# EAGLE schematic adc (EAGLE 6.5.0)
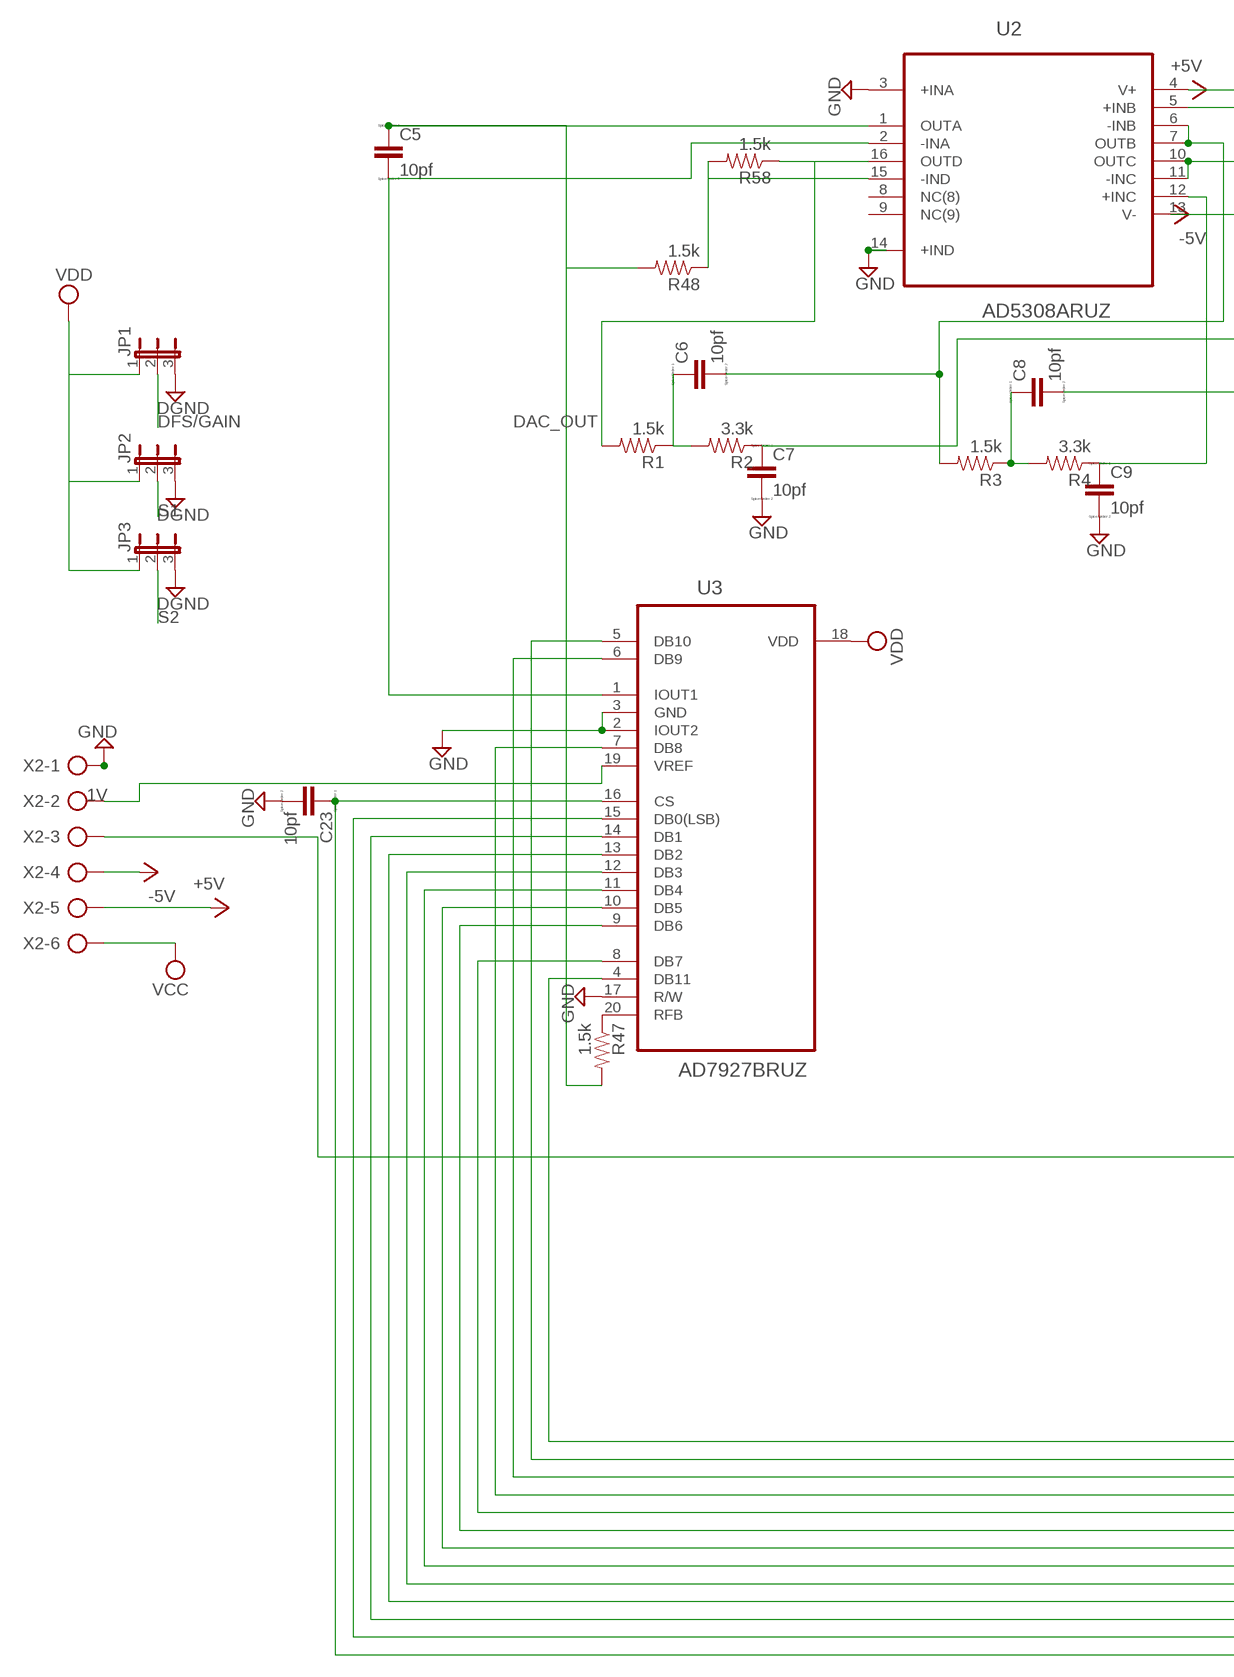
[diagram p0: schematic, sheet 1, part 1 of 2]
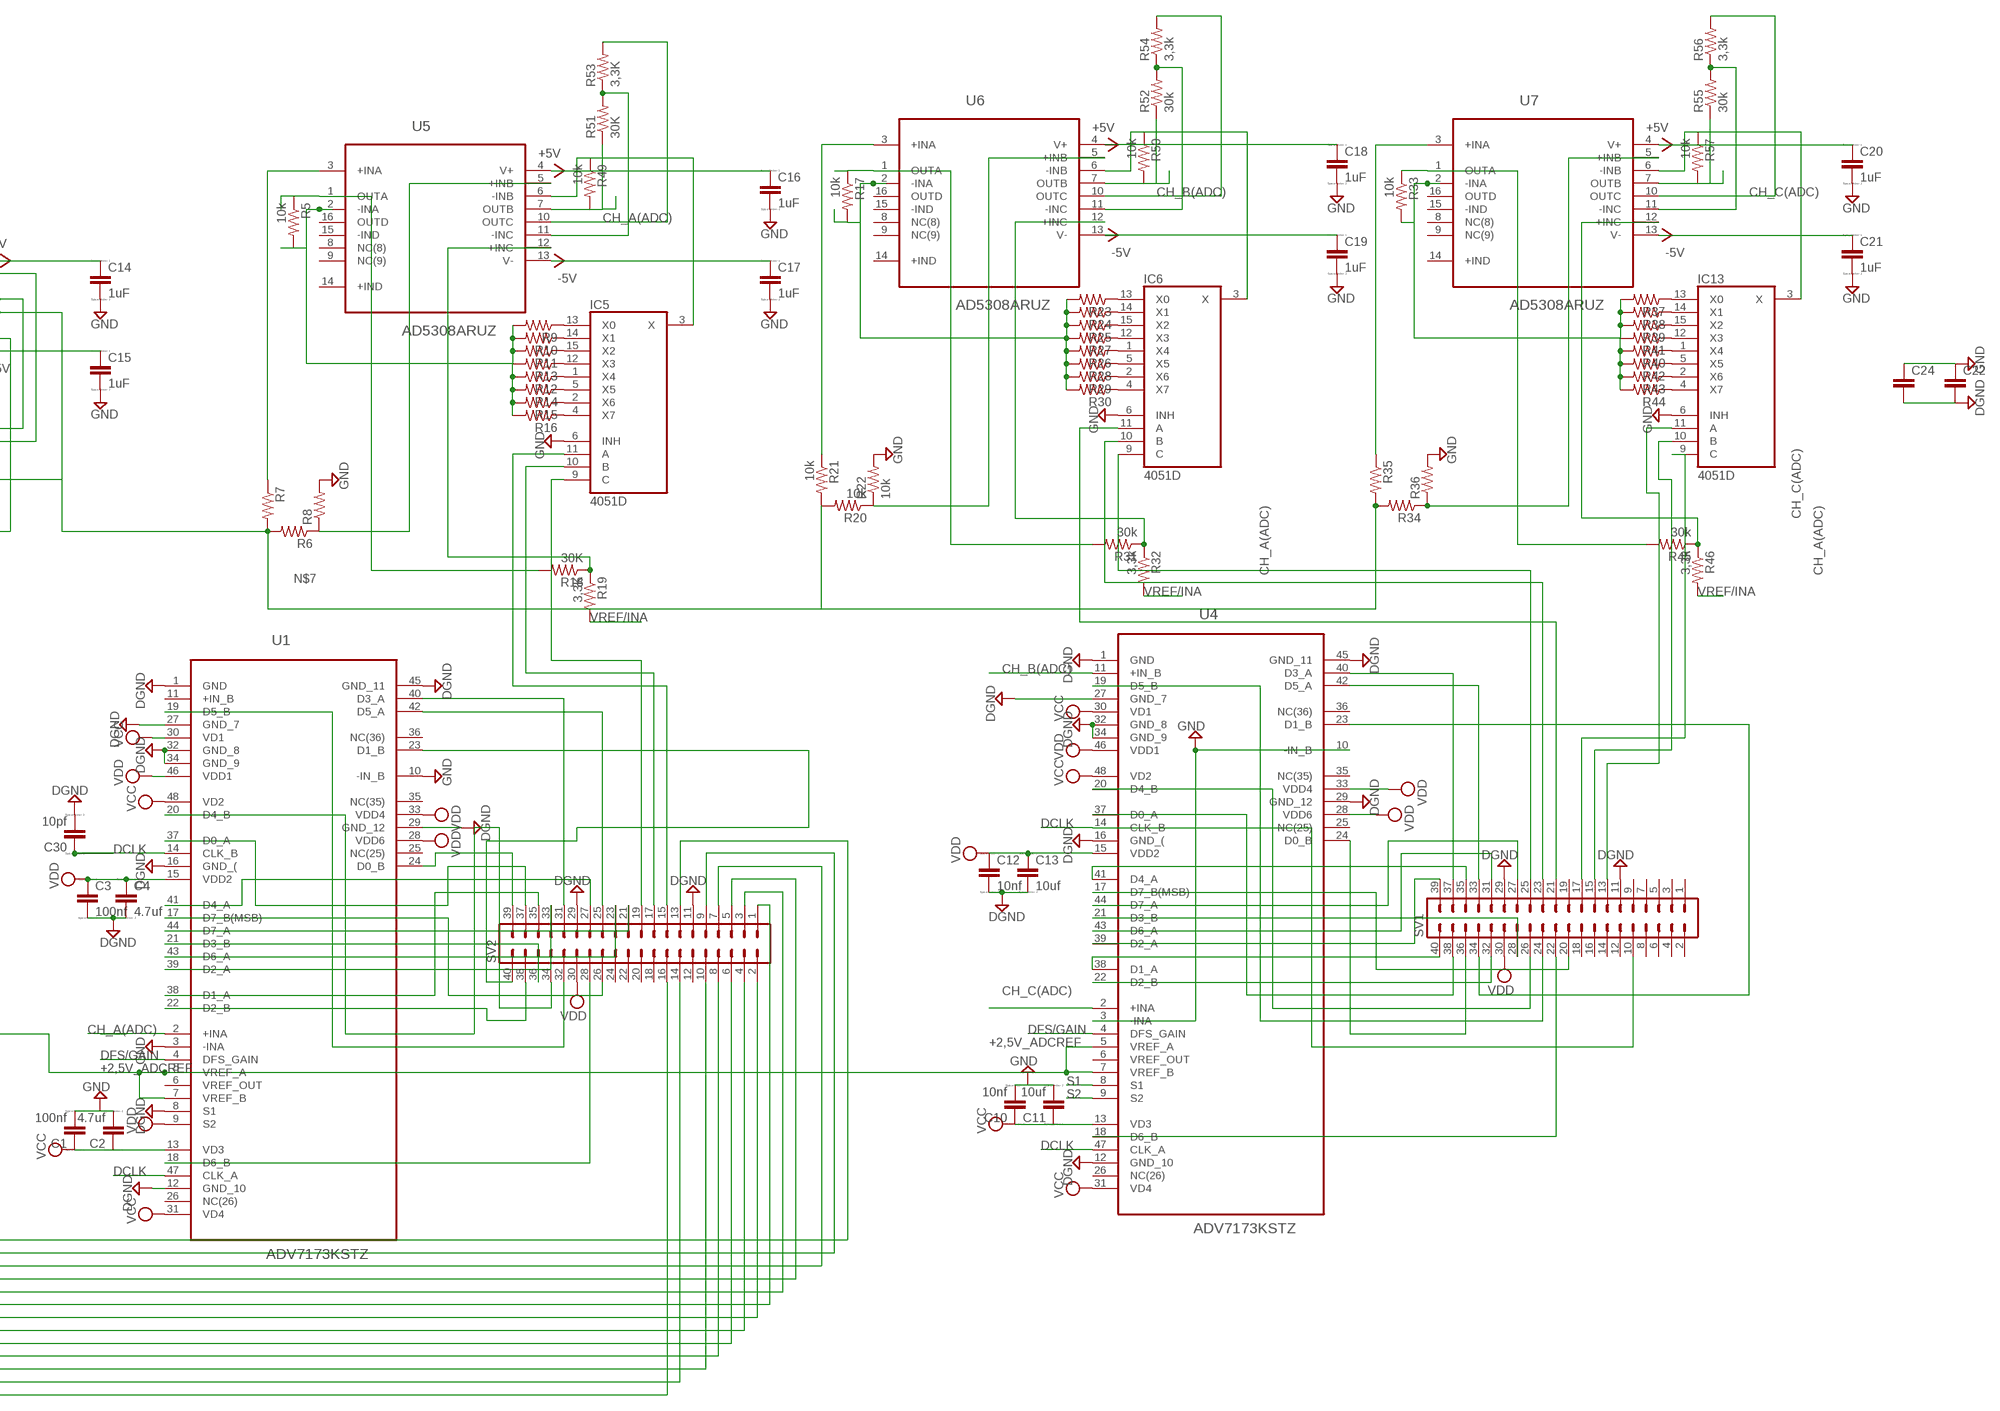
[diagram p1: schematic, sheet 1, part 2 of 2]

## Parts
C1  100nf  CC0603  [C0603]
C2  4.7uf  CC0603  [C0603]
C3  100nf  CC0603  [C0603]
C4  4.7uf  CC0603  [C0603]
C5  10pf  CC0603  [C0603]
C6  10pf  CC0603  [C0603]
C7  10pf  CC0603  [C0603]
C8  10pf  CC0603  [C0603]
C9  10pf  CC0603  [C0603]
C10  10nf  CC0603  [C0603]
C11  10uf  CC0603  [C0603]
C12  10nf  CC0603  [C0603]
C13  10uf  CC0603  [C0603]
C14  1uF  CC0603  [C0603]
C15  1uF  CC0603  [C0603]
C16  1uF  CC0603  [C0603]
C17  1uF  CC0603  [C0603]
C18  1uF  CC0603  [C0603]
C19  1uF  CC0603  [C0603]
C20  1uF  CC0603  [C0603]
C21  1uF  CC0603  [C0603]
C22  C2,5-3  [C2.5-3]
C23  10pf  CC0603  [C0603]
C24  C10/6  [C10B6]
C30  10pf  CC0603  [C0603]
IC5  4051D  [SO16]
IC6  4051D  [SO16]
IC13  4051D  [SO16]
JP1  JP2E  [JP2]
JP2  JP2E  [JP2]
JP3  JP2E  [JP2]
R1  1.5k  RESISTOR0603  [0603]
R2  3.3k  RESISTOR0603  [0603]
R3  1.5k  RESISTOR0603  [0603]
R4  3.3k  RESISTOR0603  [0603]
R5  10k  RESISTOR0603  [0603]
R6  RESISTOR0603  [0603]
R7  RESISTOR0603  [0603]
R8  RESISTOR0603  [0603]
R9  RESISTOR0603  [0603]
R10  RESISTOR0603  [0603]
R11  RESISTOR0603  [0603]
R12  RESISTOR0603  [0603]
R13  RESISTOR0603  [0603]
R14  RESISTOR0603  [0603]
R15  RESISTOR0603  [0603]
R16  RESISTOR0603  [0603]
R17  10k  RESISTOR0603  [0603]
R18  30K  RESISTOR0603  [0603]
R19  3,3K  RESISTOR0603  [0603]
R20  10k  RESISTOR0603  [0603]
R21  10k  RESISTOR0603  [0603]
R22  10k  RESISTOR0603  [0603]
R23  RESISTOR0603  [0603]
R24  RESISTOR0603  [0603]
R25  RESISTOR0603  [0603]
R26  RESISTOR0603  [0603]
R27  RESISTOR0603  [0603]
R28  RESISTOR0603  [0603]
R29  RESISTOR0603  [0603]
R30  RESISTOR0603  [0603]
R31  30k  RESISTOR0603  [0603]
R32  3,3k  RESISTOR0603  [0603]
R33  10k  RESISTOR0603  [0603]
R34  RESISTOR0603  [0603]
R35  RESISTOR0603  [0603]
R36  RESISTOR0603  [0603]
R37  RESISTOR0603  [0603]
R38  RESISTOR0603  [0603]
R39  RESISTOR0603  [0603]
R40  RESISTOR0603  [0603]
R41  RESISTOR0603  [0603]
R42  RESISTOR0603  [0603]
R43  RESISTOR0603  [0603]
R44  RESISTOR0603  [0603]
R45  30k  RESISTOR0603  [0603]
R46  3,3k  RESISTOR0603  [0603]
R47  1.5k  RESISTOR0603  [0603]
R48  1.5k  RESISTOR0603  [0603]
R49  10k  RESISTOR0603  [0603]
R50  10k  RESISTOR0603  [0603]
R51  30K  RESISTOR0603  [0603]
R52  30k  RESISTOR0603  [0603]
R53  3,3K  RESISTOR0603  [0603]
R54  3,3k  RESISTOR0603  [0603]
R55  30k  RESISTOR0603  [0603]
R56  3,3k  RESISTOR0603  [0603]
R57  10k  RESISTOR0603  [0603]
R58  1.5k  RESISTOR0603  [0603]
SV1  MA20-2  [MA20-2]
SV2  MA20-2  [MA20-2]
U1  ADV7173KSTZ  [QFP50P900X900X160-48N]
U2  AD5308ARUZ  [SOP65P640X120-16N]
U3  AD7927BRUZ  [SOP65P640X120-20N]
U4  ADV7173KSTZ  [QFP50P900X900X160-48N]
U5  AD5308ARUZ  [SOP65P640X120-16N]
U6  AD5308ARUZ  [SOP65P640X120-16N]
U7  AD5308ARUZ  [SOP65P640X120-16N]
X2  AK300/6  [AK300/6]

## Nets
1V: U3.19(VREF) X2.2
+2,5V_ADCREF: U1.5(VREF_A) U1.7(VREF_B) U4.5(VREF_A) U4.7(VREF_B) X2.3
+5V: C14.1 C16.1 C18.1 C20.1 U2.4(V+) U5.4(V+) U6.4(V+) U7.4(V+) X2.5
-5V: C15.1 C17.1 C19.1 C21.1 U2.13(V-) U5.13(V-) U6.13(V-) U7.13(V-) X2.4
CH_A(ADC): R53.2 U1.2(+INA) U5.10(OUTC)
CH_B(ADC): R54.2 U4.11(+IN_B) U6.10(OUTC)
CH_C(ADC): R56.2 U4.2(+INA) U7.10(OUTC)
DAC_OUT: C5.1 R47.2 R48.2 U2.1(OUTA)
DCLK: C30.1 SV1.10 U1.14(CLK_B) U1.47(CLK_A) U4.14(CLK_B) U4.47(CLK_A)
DFS/GAIN: JP1.2 U1.4(DFS_GAIN) U4.4(DFS_GAIN)
DGND: C3.2 C4.2 C12.2 C13.2 C22.2 C24.2 C30.2 JP1.3 JP2.3 JP3.3 SV1.11 SV1.29 SV2.11 SV2.29 U1.1(GND) U1.8(S1) U1.12(GND_10) U1.16(GND_() U1.27(GND_7) U1.29(GND_12) U1.32(GND_8) U1.34(GND_9) U1.45(GND_11) U4.1(GND) U4.12(GND_10) U4.16(GND_() U4.27(GND_7) U4.29(GND_12) U4.32(GND_8) U4.34(GND_9) U4.45(GND_11)
GND: C1.2 C2.2 C7.2 C9.2 C10.2 C11.2 C14.2 C15.2 C16.2 C17.2 C18.2 C19.2 C20.2 C21.2 C22.1 C23.2 C24.1 IC5.6(INH) IC6.6(INH) IC13.6(INH) R8.2 R22.2 R36.2 U1.3(-INA) U1.10(-IN_B) U2.3(+INA) U2.14(+IND) U3.2(IOUT2) U3.3(GND) U3.17(R/W) U4.3(-INA) U4.10(-IN_B) X2.1
N$1: C7.1 R2.1 U2.5(+INB)
N$2: C6.1 R1.1 R2.2
N$3: R48.1 R58.2 U2.15(-IND)
N$4: C6.2 R3.2 U2.6(-INB) U2.7(OUTB)
N$5: C9.1 R4.1 U2.12(+INC)
N$6: C8.1 R3.1 R4.2
N$7: C8.2 R6.2 R7.2 R20.2 R21.2 R34.2 R35.2 U2.10(OUTC) U2.11(-INC)
N$9: SV2.31 U1.40(D3_A)
N$10: SV2.25 U1.42(D5_A)
N$11: SV2.39 U1.24(D0_B)
N$12: SV2.32 U1.19(D5_B)
N$13: SV2.34 U1.20(D4_B)
N$14: SV2.37 U1.37(D0_A)
N$15: SV2.27 U1.41(D4_A)
N$16: SV2.21 U1.44(D7_A)
N$17: SV2.36 U1.21(D3_B)
N$18: SV2.23 U1.43(D6_A)
N$19: SV2.33 U1.39(D2_A)
N$20: SV2.35 U1.38(D1_A)
N$21: SV2.38 U1.22(D2_B)
N$22: SV2.28 U1.18(D6_B)
N$23: SV2.26 U1.17(D7_B(MSB))
N$24: SV2.13 U3.4(DB11)
N$25: SV2.40 U1.23(D1_B)
N$26: SV2.9 U3.5(DB10)
N$27: SV2.7 U3.6(DB9)
N$28: SV2.5 U3.7(DB8)
N$29: SV2.3 U3.8(DB7)
N$30: SV2.1 U3.9(DB6)
N$31: SV2.2 U3.10(DB5)
N$32: SV2.4 U3.11(DB4)
N$33: SV2.6 U3.12(DB3)
N$34: SV2.8 U3.13(DB2)
N$35: SV2.10 U3.14(DB1)
N$36: SV2.14 U3.15(DB0(LSB))
N$37: SV1.38 U4.37(D0_A)
N$38: IC5.13(X0) R9.1
N$39: IC5.14(X1) R10.1
N$40: IC5.15(X2) R11.1
N$41: IC5.1(X4) R12.1
N$42: IC5.12(X3) R13.1
N$43: IC5.5(X5) R14.1
N$44: IC5.2(X6) R15.1
N$45: IC5.4(X7) R16.1
N$46: IC6.13(X0) R23.1
N$47: IC6.14(X1) R24.1
N$48: R17.2 R23.2 R24.2 R25.2 R26.2 R27.2 R28.2 R29.2 R30.2 U6.2(-INA)
N$49: R5.2 R9.2 R10.2 R11.2 R12.2 R13.2 R14.2 R15.2 R16.2 U5.2(-INA)
N$50: R18.1 R19.1 U5.12(+INC)
N$51: R49.2 R51.1 U5.7(OUTB)
N$52: IC6.15(X2) R25.1
N$53: IC6.1(X4) R26.1
N$54: IC6.12(X3) R27.1
N$55: IC6.5(X5) R28.1
N$56: IC6.2(X6) R29.1
N$57: IC6.4(X7) R30.1
N$58: R52.2 R54.1 U6.11(-INC)
N$60: R33.1 R45.2 U7.1(OUTA)
N$61: IC13.3(X) R57.1 U7.6(-INB)
N$62: IC13.13(X0) R37.1
N$63: IC13.14(X1) R38.1
N$64: IC13.15(X2) R39.1
N$65: IC13.1(X4) R40.1
N$66: IC13.12(X3) R41.1
N$67: IC13.5(X5) R42.1
N$68: IC13.2(X6) R43.1
N$69: IC13.4(X7) R44.1
N$70: R34.1 R36.1 U7.5(+INB)
N$71: R6.1 R8.1 U5.5(+INB)
N$72: R20.1 R22.1 U6.5(+INB)
N$73: R7.1 U5.3(+INA)
N$74: SV1.40 U4.38(D1_A)
N$75: SV1.39 U4.39(D2_A)
N$76: SV1.36 U4.24(D0_B)
N$77: SV1.24 U4.19(D5_B)
N$78: SV1.26 U4.20(D4_B)
N$79: SV1.37 U4.40(D3_A)
N$80: SV1.35 U4.41(D4_A)
N$81: SV1.33 U4.42(D5_A)
N$82: SV1.28 U4.21(D3_B)
N$83: SV1.31 U4.43(D6_A)
N$84: SV1.27 U4.44(D7_A)
N$86: SV1.32 U4.22(D2_B)
N$87: SV1.22 U4.18(D6_B)
N$88: SV1.20 U4.17(D7_B(MSB))
N$89: SV1.34 U4.23(D1_B)
N$90: IC5.9(C) SV2.19
N$91: IC5.10(B) SV2.17
N$93: IC13.9(C) SV1.17
N$94: IC13.10(B) SV1.15
N$95: IC13.11(A) SV1.13
N$96: IC6.9(C) SV1.25
N$97: IC6.10(B) SV1.23
N$98: IC6.11(A) SV1.21
N$99: IC5.3(X) R49.1 U5.6(-INB)
N$101: R31.1 R32.1 U6.12(+INC)
N$102: R33.2 R37.2 R38.2 R39.2 R40.2 R41.2 R42.2 R43.2 R44.2 U7.2(-INA)
N$103: C5.2 U2.2(-INA) U3.1(IOUT1)
N$104: R45.1 R46.1 U7.12(+INC)
N$105: R5.1 R18.2 U5.1(OUTA)
N$106: R35.1 U7.3(+INA)
N$107: R21.1 U6.3(+INA)
N$109: R47.1 U3.20(RFB)
N$110: IC5.11(A) SV2.15
N$111: C23.1 SV2.16 U3.16(CS)
N$114: R55.2 R56.1 U7.11(-INC)
N$117: R51.2 R53.1 U5.11(-INC)
N$119: R55.1 R57.2 U7.7(OUTB)
N$120: R17.1 R31.2 U6.1(OUTA)
N$121: R50.2 R52.1 U6.7(OUTB)
N$122: IC6.3(X) R50.1 U6.6(-INB)
N$124: R1.2 R58.1 U2.16(OUTD)
S1: JP2.2 U4.8(S1)
S2: JP3.2 U4.9(S2)
VCC: C1.1 C2.1 C10.1 C11.1 U1.13(VD3) U1.30(VD1) U1.31(VD4) U1.48(VD2) U4.13(VD3) U4.30(VD1) U4.31(VD4) U4.48(VD2) X2.6
VDD: C3.1 C4.1 C12.1 C13.1 JP1.1 JP2.1 JP3.1 SV1.30 SV2.30 U1.9(S2) U1.15(VDD2) U1.28(VDD6) U1.33(VDD4) U1.46(VDD1) U3.18(VDD) U4.15(VDD2) U4.28(VDD6) U4.33(VDD4) U4.46(VDD1)
VREF/INA: R19.2 R32.2 R46.2
Unconnected: SV1.1 SV1.2 SV1.3 SV1.4 SV1.5 SV1.6 SV1.7 SV1.8 SV1.9 SV1.12 SV1.14 SV1.16 SV1.18 SV1.19 SV2.12 SV2.18 SV2.20 SV2.22 SV2.24 U1.6(VREF_OUT) U1.25(NC(25)) U1.26(NC(26)) U1.35(NC(35)) U1.36(NC(36)) U2.8(NC(8)) U2.9(NC(9)) U4.6(VREF_OUT) U4.25(NC(25)) U4.26(NC(26)) U4.35(NC(35)) U4.36(NC(36)) U5.8(NC(8)) U5.9(NC(9)) U5.14(+IND) U5.15(-IND) U5.16(OUTD) U6.8(NC(8)) U6.9(NC(9)) U6.14(+IND) U6.15(-IND) U6.16(OUTD) U7.8(NC(8)) U7.9(NC(9)) U7.14(+IND) U7.15(-IND) U7.16(OUTD)

## Power pins joined to a net without a drawn wire
+5V: IC5.16(+5V) IC6.16(+5V) IC13.16(+5V)
+IN_B: U1.11(+IN_B)
GND: IC5.8(GND) IC6.8(GND) IC13.8(GND)
VEE: IC5.7(VEE) IC6.7(VEE) IC13.7(VEE)

## Library data of the parts
C1-C21 C23 C30 = eagle-ltspice:C: CAPACITOR, European symbol; SPICEMODEL: NONE; SPICEPREFIX: C
C22 C24 = capacitor-wima:C: CAPACITOR naming: grid - package width
IC5 IC6 IC13 = 40xx:4051: 8-channel ANALOG MULTIPLEXER
JP1-JP3 = jumper:JP2E: JUMPER
R1-R58 = SparkFun:RESISTOR: Resistor Basic schematic elements and footprints for 0603, 1206, and PTH 1/10th watt (small) resistors.
SV1 SV2 = con-lstb:MA20-2: PIN HEADER; OC_FARNELL: unknown; OC_NEWARK: unknown
U1 U4 = ADI-Phase-2:ADV7173KSTZ: LQFP-48,Digital PAL/NTSC Video Encoder; MPN: ADV7173KSTZ; OC_FARNELL: unknown; OC_NEWARK: 82H2834; PACKAGE: LQFP-48; SUPPLIER: Analog Devices
U2 U5-U7 = Analog Devices_By_element14_Batch_1:AD5308ARUZ: 2.5 V to 5.5 V Octal Voltage Output 8-/10-/12-Bit DACs in 16-Lead TSSOP; MPN: AD5308ARUZ; OC_FARNELL: 1423753; OC_NEWARK: 59K3883; PACKAGE: TSSOP-16; SUPPLIER: Analog Devices
U3 = Analog Devices_By_element14_Batch_1:AD7927BRUZ: 8-Channel, 200 kSPS, 12-Bit ADC with Sequencer in 20-Lead TSSOP; MPN: AD7927BRUZ; OC_FARNELL: 1581944; OC_NEWARK: 19M8862; PACKAGE: TSSOP-20; SUPPLIER: Analog devices
X2 = con-ptr500:AK300/6: CONNECTOR; OC_FARNELL: unknown; OC_NEWARK: unknown